# Altium schematic sheet GPIOSheet.SchDoc
size A; SheetNumber: 4; SheetTotal: 6
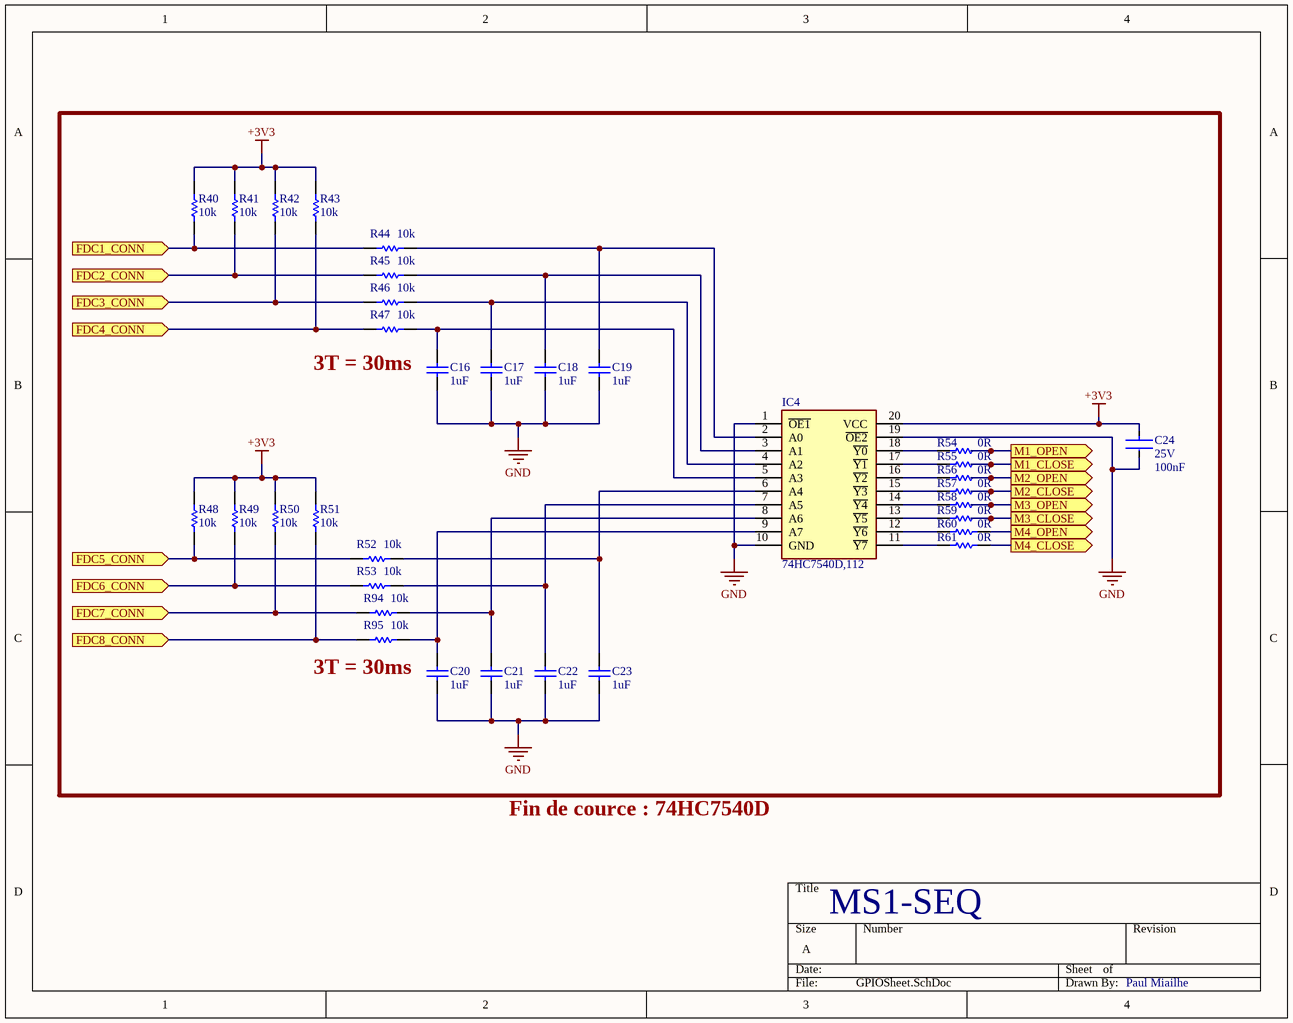
[diagram p0: GPIOSheet.SchDoc]

## Parts
C16  Capacitance: 1uF  [CAPC1608X90X35LL10T15]  (hidden comment: GRM188R61E105KA12D)
C17  Capacitance: 1uF  [CAPC1608X90X35LL10T15]  (hidden comment: GRM188R61E105KA12D)
C18  Capacitance: 1uF  [CAPC1608X90X35LL10T15]  (hidden comment: GRM188R61E105KA12D)
C19  Capacitance: 1uF  [CAPC1608X90X35LL10T15]  (hidden comment: GRM188R61E105KA12D)
C20  Capacitance: 1uF  [CAPC1608X90X35LL10T15]  (hidden comment: GRM188R61E105KA12D)
C21  Capacitance: 1uF  [CAPC1608X90X35LL10T15]  (hidden comment: GRM188R61E105KA12D)
C22  Capacitance: 1uF  [CAPC1608X90X35LL10T15]  (hidden comment: GRM188R61E105KA12D)
C23  Capacitance: 1uF  [CAPC1608X90X35LL10T15]  (hidden comment: GRM188R61E105KA12D)
C24  Voltage Rating (DC): 25V  Capacitance: 100nF  [FP-CGA3E-0_3-0_1-MFG]  (hidden comment: CGA3E2X7R1E104K080AA)
IC4  74HC7540D,112  [SOIC127P1032X265-20N]
R40  Resistance: 10k  [RESC1609X55X30LL15T15]  (hidden comment: ERJ3EKF1002V)
R41  Resistance: 10k  [RESC1609X55X30LL15T15]  (hidden comment: ERJ3EKF1002V)
R42  Resistance: 10k  [RESC1609X55X30LL15T15]  (hidden comment: ERJ3EKF1002V)
R43  Resistance: 10k  [RESC1609X55X30LL15T15]  (hidden comment: ERJ3EKF1002V)
R44  Resistance: 10k  [RESC1609X55X30LL15T15]  (hidden comment: ERJ3EKF1002V)
R45  Resistance: 10k  [RESC1609X55X30LL15T15]  (hidden comment: ERJ3EKF1002V)
R46  Resistance: 10k  [RESC1609X55X30LL15T15]  (hidden comment: ERJ3EKF1002V)
R47  Resistance: 10k  [RESC1609X55X30LL15T15]  (hidden comment: ERJ3EKF1002V)
R48  Resistance: 10k  [RESC1609X55X30LL15T15]  (hidden comment: ERJ3EKF1002V)
R49  Resistance: 10k  [RESC1609X55X30LL15T15]  (hidden comment: ERJ3EKF1002V)
R50  Resistance: 10k  [RESC1609X55X30LL15T15]  (hidden comment: ERJ3EKF1002V)
R51  Resistance: 10k  [RESC1609X55X30LL15T15]  (hidden comment: ERJ3EKF1002V)
R52  Resistance: 10k  [RESC1609X55X30LL15T15]  (hidden comment: ERJ3EKF1002V)
R53  Resistance: 10k  [RESC1609X55X30LL15T15]  (hidden comment: ERJ3EKF1002V)
R54  0R  [RESC1608X55X25ML10T15]
R55  0R  [RESC1608X55X25ML10T15]
R56  0R  [RESC1608X55X25ML10T15]
R57  0R  [RESC1608X55X25ML10T15]
R58  0R  [RESC1608X55X25ML10T15]
R59  0R  [RESC1608X55X25ML10T15]
R60  0R  [RESC1608X55X25ML10T15]
R61  0R  [RESC1608X55X25ML10T15]
R94  Resistance: 10k  [RESC1609X55X30LL15T15]  (hidden comment: ERJ3EKF1002V)
R95  Resistance: 10k  [RESC1609X55X30LL15T15]  (hidden comment: ERJ3EKF1002V)

## Ports
FDC1_CONN (in), FDC2_CONN (in), FDC3_CONN (in), FDC4_CONN (in), FDC5_CONN (in), FDC6_CONN (in), FDC7_CONN (in), FDC8_CONN (in), M1_CLOSE (out), M1_OPEN (out), M2_CLOSE (out), M2_OPEN (out), M3_CLOSE (out), M3_OPEN (out), M4_CLOSE (out), M4_OPEN (out)

## Nets
+3V3: C24.1 IC4.20(VCC) R40.2 R41.2 R42.2 R43.2 R48.2 R49.2 R50.2 R51.2
GND: C16.1 C17.1 C18.1 C19.1 C20.1 C21.1 C22.1 C23.1 C24.2 IC4.1(~{OE1}) IC4.10(GND) IC4.19(~{OE2})
FDC1_CONN: R40.1 R44.2 ; port FDC1_CONN
FDC2_CONN: R41.1 R45.2 ; port FDC2_CONN
FDC3_CONN: R42.1 R46.2 ; port FDC3_CONN
FDC4_CONN: R43.1 R47.2 ; port FDC4_CONN
FDC5_CONN: R48.1 R52.2 ; port FDC5_CONN
FDC6_CONN: R49.1 R53.2 ; port FDC6_CONN
FDC7_CONN: R50.1 R94.2 ; port FDC7_CONN
FDC8_CONN: R51.1 R95.2 ; port FDC8_CONN
M1_CLOSE: R55.2 ; port M1_CLOSE
M1_OPEN: R54.2 ; port M1_OPEN
M2_CLOSE: R57.2 ; port M2_CLOSE
M2_OPEN: R56.2 ; port M2_OPEN
M3_CLOSE: R59.2 ; port M3_CLOSE
M3_OPEN: R58.2 ; port M3_OPEN
M4_CLOSE: R61.2 ; port M4_CLOSE
M4_OPEN: R60.2 ; port M4_OPEN
NetC16_2: C16.2 IC4.5(A3) R47.1
NetC17_2: C17.2 IC4.4(A2) R46.1
NetC18_2: C18.2 IC4.3(A1) R45.1
NetC19_2: C19.2 IC4.2(A0) R44.1
NetC20_2: C20.2 IC4.9(A7) R95.1
NetC21_2: C21.2 IC4.8(A6) R94.1
NetC22_2: C22.2 IC4.7(A5) R53.1
NetC23_2: C23.2 IC4.6(A4) R52.1
NetIC4_11: IC4.11(~{Y7}) R61.1
NetIC4_12: IC4.12(~{Y6}) R60.1
NetIC4_13: IC4.13(~{Y5}) R59.1
NetIC4_14: IC4.14(~{Y4}) R58.1
NetIC4_15: IC4.15(~{Y3}) R57.1
NetIC4_16: IC4.16(~{Y2}) R56.1
NetIC4_17: IC4.17(~{Y1}) R55.1
NetIC4_18: IC4.18(~{Y0}) R54.1

## Notes on the sheet
- 3T = 30ms
- Fin de cource : 74HC7540D
- MS1-SEQ
- Paul Miailhe

## Library data of the parts
C16-C23 = CMP-2006-02459-1: Manufacturer: Murata; Description: 0603 1 uF 25 V ±10% Tolerance X5R SMT Multilayer Ceramic Capacitor; Material: Ceramic; Tolerance: 10%; Voltage Rating: 25V; Dielectric: X5R; Part Number: GRM188R61E105KA12D; Supplier 1: Farnell; Supplier Part Number 1: 1828802; Manufacturer Part Number: GRM188R61E105KA12D; RoHS: Yes; Category: Ceramic Capacitors; Pricing 1: 10=0.13400, 100=0.05920, 500=0.03800, 1000=0.03090 (GBP); Mount: Surface Mount; Case/Package: 0603; Number of Pins: 2; Case Code (Metric): 1608; Case Code (Imperial): 0603; Min Operating Temperature: -55°C; Max Operating Temperature: 85°C; Packaging: Tape and Reel; Package Quantity: 4000; Voltage Rating (DC): 25V; Termination: SMD/SMT; Voltage: 25V; Length: 1.6mm; Width: 0.031inch; Height: 0.8mm; Depth: 0.8mm; Thickness: 0.035inch; Radiation Hardening: No; RoHS Compliant: Yes; REACH SVHC: No SVHC; Lead Free: Lead Free
C24 = CMP-08246-002186-1: Cap Ceramic 100nF 25V X7R 10% Pad SMD 0603 +125°C Automotive T/R; Manufacturer: TDK; Composition: Ceramic; Dielectric: X7R; Ratings: AEC-Q200; Length: 1.6mm; REACH SVHC: No SVHC; Width: 0.031inch; Packaging: Tape and Reel; Case/Package: 0603; Height: 0.8mm; Termination: SMD/SMT; Max Operating Temperature: 125°C; Thickness: 0.035inch; Case Code (Metric): 1608; Lead Free: Lead Free; Mount: Surface Mount; Voltage Rating: 25V; Tolerance: 10%; Weight: 7.1E-05oz; Min Operating Temperature: -55°C; Package Quantity: 1; Depth: 0.8mm; Case Code (Imperial): 0603; Supplier 1: Mouser; Supplier Part Number 1: 810-CGA3E2X7R1E104K; Manufacturer Part Number: CGA3E2X7R1E104K080AA; RoHS: Yes; Category: Ceramic Capacitors; Stock 1: 488891; Pricing 1: 1=0,12000, 10=0,05600, 50=0,05600, 100=0,02500, 1000=0,01400, 10000=0,01000 (USD); Series: CGA; Resistor Type: Ceramic; RoHS Compliant: Yes; ComponentLink1URL: https://datasheet.ciiva.com/24220/cga3e2x7r1e104k080aa-265934-24220022.pdf?src-supplier=Mouser; ComponentLink1Description: https://datasheet.ciiva.com/24220/cga3e2x7r1e104k080aa-265934-24220022.pdf?src-supplier=Mouser; ComponentLink2URL: https://datasheet.ciiva.com/22725/1735392-22725638.pdf?src-supplier=Element14; ComponentLink2Description: https://datasheet.ciiva.com/22725/1735392-22725638.pdf?src-supplier=Element14; ComponentLink3URL: https://datasheet.ciiva.com/22725/1735392-22725639.pdf?src-supplier=Element14; ComponentLink3Description: https://datasheet.ciiva.com/22725/1735392-22725639.pdf?src-supplier=Element14; ComponentLink4URL: https://datasheet.ciiva.com/16427/mlccspec-automotive-general-midvoltage-en-16427320.pdf?src-supplier=Future+Electronics; ComponentLink4Description: https://datasheet.ciiva.com/16427/mlccspec-automotive-general-midvoltage-en-16427320.pdf?src-supplier=Future+Electronics; ComponentLink5URL: https://datasheet.ciiva.com/23803/1735392-23803082.pdf?src-supplier=Newark; ComponentLink5Description: https://datasheet.ciiva.com/23803/1735392-23803082.pdf?src-supplier=Newark
IC4 = 74HC7540D,112: Integrated Circuit; Manufacturer_Name: Nexperia; Datasheet Link: https://assets.nexperia.com/documents/data-sheet/74HC_HCT7540.pdf; Height: 2.65mm; Manufacturer_Part_Number: 74HC7540D,112; Mouser Part Number: 771-HC7540D112; Mouser Price/Stock: https://www.mouser.co.uk/ProductDetail/Nexperia/74HC7540D112?qs=P62ublwmbi92dGW19WIHEQ%3D%3D; Arrow Part Number: 74HC7540D,112; Arrow Price/Stock: https://www.arrow.com/en/products/74hc7540d112/nexperia
R40-R53 R94 R95 = CMP-1012-00623-3: Chip Resistor, 10 KOhm, +/- 1%, 0.1 W, -55 to 155 degC, 0603 (1608 Metric), RoHS, Tape and Reel; Manufacturer: Panasonic; Manufacturer Part Number: ERJ-3EKF1002V; Voltage Rating: 75V; Case\/Package: 0603; Power Rating: 100mW; Temperature Coefficient: 100ppm\/degreesC; Number of Pins: 2; Package Reference: 603; Depth: 0.8mm; Mount: SurfaceMount; Package Description: 2-Pin Surface Mount Device, Body 1.6 x 0.85 mm; Datasheet Version: 02/2017; Length: 1.6mm; Lead Free: LeadFree; Height: 0.45mm; Number of Terminations: 2; Max Power Dissipation: 100mW; Min Operating Temperature: -55degC; Datasheet URL: https://industrial.panasonic.com/cdbs/www-data/pdf/RDA0000/AOA0000C304.pdf; Termination: SMD/SMT; Case Code (Metric): 1608; Tolerance: 1%; Max Operating Temperature: 155degC; RoHSCompliant: true; Voltage Rating (DC): 75V; Radiation Hardening: No; Packaging: TapeandReel; Composition: ThickFilm; Mounting Technology: SurfaceMount; Manufacturer URL: http://www.panasonic.com/; Width: 0.031inch; REACH SVHC: NoSVHC; Contact Plating: Tin; Military Standard: Not; Package Quantity: 1; Supplier 1: Mouser; Supplier Part Number 1: 667-ERJ-3EKF1002V; RoHS: Yes; Category: Chip SMD Resistors; Stock 1: 20455; Pricing 1: 1=0,10000, 10=0,04000, 50=0,04000, 100=0,01700, 1000=0,00700, 5000=0,00500, 10000=0,00500 (USD); Case/Package: 0603; Size Code: 0603; Resistor Type: Thick Film; Series: ERJ; Resistance Tolerance: 1%; Construction: Rectangular; Features: Automotive AEC-Q200; Technology: THICK FILM; RoHS Compliant: Yes; ComponentLink1URL: https://datasheet.ciiva.com/16511/aoa0000ce2-16511861.pdf?src-supplier=Avnet+Asia; ComponentLink1Description: https://datasheet.ciiva.com/16511/aoa0000ce2-16511861.pdf?src-supplier=Avnet+Asia; ComponentLink2URL: https://datasheet.ciiva.com/46372/1678782-46372725.pdf?src-supplier=Element14; ComponentLink2Description: https://datasheet.ciiva.com/46372/1678782-46372725.pdf?src-supplier=Element14; ComponentLink3URL: https://datasheet.ciiva.com/28514/426256-28514198.pdf?src-supplier=Element14; ComponentLink3Description: https://datasheet.ciiva.com/28514/426256-28514198.pdf?src-supplier=Element14; ComponentLink4URL: https://datasheet.ciiva.com/9194/aoa0000ce2-9194199.pdf?src-supplier=Avnet; ComponentLink4Description: https://datasheet.ciiva.com/9194/aoa0000ce2-9194199.pdf?src-supplier=Avnet; ComponentLink5URL: https://datasheet.ciiva.com/7830/aoa0000ce2-7830729.pdf?src-supplier=Element14; ComponentLink5Description: https://datasheet.ciiva.com/7830/aoa0000ce2-7830729.pdf?src-supplier=Element14; ComponentLink6URL: https://datasheet.ciiva.com/17212/aoa0000ce2-17212105.pdf?src-supplier=Avnet+Europe; ComponentLink6Description: https://datasheet.ciiva.com/17212/aoa0000ce2-17212105.pdf?src-supplier=Avnet+Europe; ComponentLink7URL: https://datasheet.ciiva.com/30208/aoa0000ce2-30208985.pdf?src-supplier=Onlinecomponents.com; ComponentLink7Description: https://datasheet.ciiva.com/30208/aoa0000ce2-30208985.pdf?src-supplier=Onlinecomponents.com; ComponentLink8URL: https://datasheet.ciiva.com/48530/aoa0000ce2-48530988.pdf?src-supplier=Avnet; ComponentLink8Description: https://datasheet.ciiva.com/48530/aoa0000ce2-48530988.pdf?src-supplier=Avnet; ComponentLink9URL: https://datasheet.ciiva.com/24070/aoa0000ce2-24070318.pdf?src-supplier=Mouser; ComponentLink9Description: https://datasheet.ciiva.com/24070/aoa0000ce2-24070318.pdf?src-supplier=Mouser; ComponentLink10URL: https://datasheet.ciiva.com/16759/70260748-16759807.pdf?src-supplier=Allied+Electronics; ComponentLink10Description: https://datasheet.ciiva.com/16759/70260748-16759807.pdf?src-supplier=Allied+Electronics
R54-R61 = CMP-2100-03667-1: Chip Resistor, 0 Ohm, +/- 5%, 0.1 W, -55 to 155 degC, 0603 (1608 Metric), RoHS, Tape and Reel; Manufacturer: Yageo; Temperature Coefficient: 200ppm/degreesC; Voltage Rating: 50V; Power Rating: 100mW; Resistance: 0mOhm; Width: 0.8mm; Max Operating Temperature: 155degC; Tolerance: 5%; Package Reference: 0603; Height: 0.45mm; Depth: 0.8mm; Package Description: 2-Pin Surface Mount Device, Body 1.6 x 0.8 mm; Termination: SMD/SMT; Package Quantity: 5000; Case/Package: 0603; Case Code (Imperial): 0603; Radiation Hardening: No; Number of Pins: 2; Length: 1.6mm; Lead Free: LeadFree; Voltage Rating (DC): 50V; Military Standard: Not; Datasheet URL: http://www.yageo.com/NewPortal/yageodocoutput?fileName=/pdf/R-Chip/PYu-RC_Group_51_RoHS_L_5.pdf; Manufacturer URL: http://www.yageo.com/; Packaging: TapeandReel; Case Code (Metric): 1608; Min Operating Temperature: -55degC; Composition: ThickFilm; RoHSCompliant: true; Contact Plating: Tin; Datasheet Version: Rev. 5, 10/2016; REACH SVHC: NoSVHC